# EAGLE design converter (EAGLE 9.4.2)
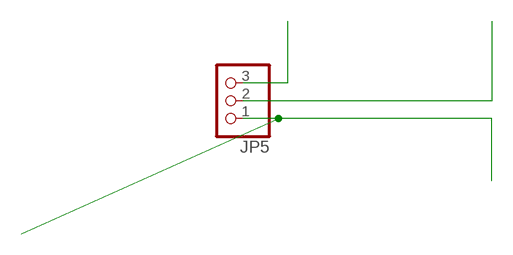
[diagram p0: schematic, sheet 1]

## Parts
JP5  PINHD-1X3  [1X03]

## Nets
N$1: JP5.3
N$2: JP5.2
N$3: JP5.1

## Library data of the parts
JP5 = pinhead:PINHD-1X3: PIN HEADER

## Board
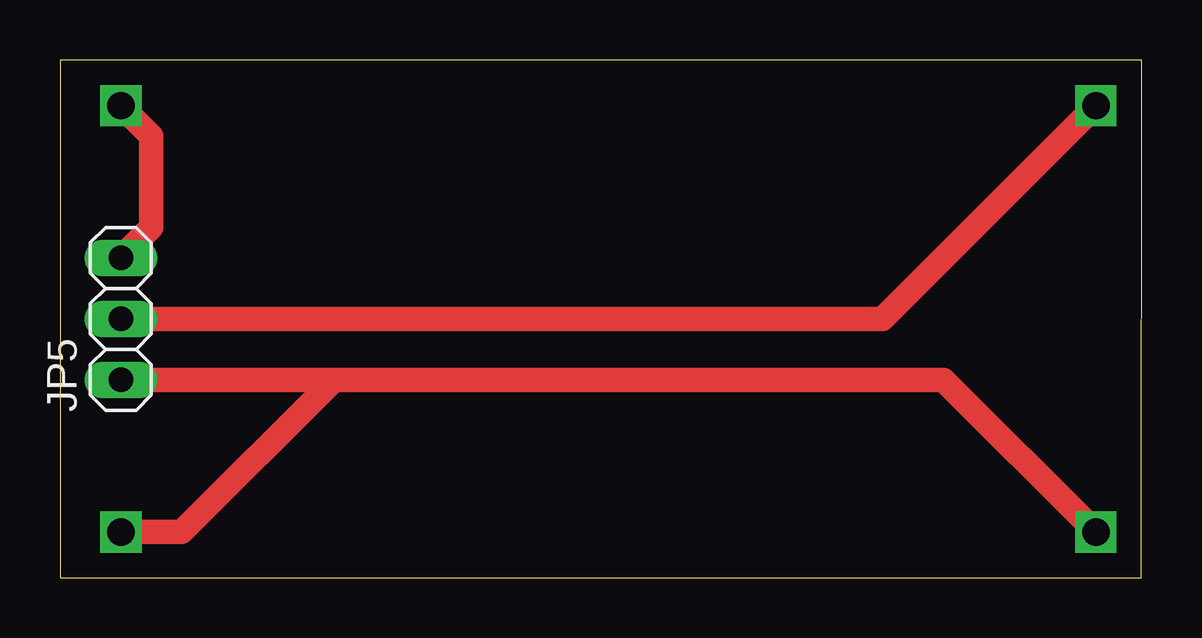
[diagram p1: board, top side]

Size 45.09 x 21.59 mm. Coordinates in mm from the lower left corner, seen from the top.
Outline: 0,0 45.07,0 45.09,21.59 0,21.59 0,0
Copper layers (1*16): Top 0.035mm / dielectric 1.5mm / Bottom 0.035mm
Design rules "default": minimum track width 6mil, minimum drill 0.35mm, track to track 6mil, track to pad 6mil, pad to pad 6mil, via to via 6mil, smd to smd 6mil, copper to edge 40mil, drill to drill 6mil, minimum pad ring 10mil, minimum via ring 8mil, stop-mask expansion 4mil, vias tented up to drill 0mil, thermal gap 10mil

### Footprints (pad centres in the part's own frame; a part is rotated, then mirrored left to right if it is on the bottom)
1X03 = drill 1.016 long: 1 -2.54,0; 2 0,0; 3 2.54,0

### Placement (x,y rotation side)
JP5  2.54,10.8 90 top

### Tracks (layer width: path | path; a pad name or v marks a point on that pad's centre or on a via)
N$1  (via drill 1.14)
  Top 1.016: JP5.3 3.81,14.61 3.81,18.41 v2.54,19.68
N$2  (via drill 1.14)
  Top 1.016: JP5.2 34.29,10.8 v43.18,19.68
N$3  (via drill 1.14)
  Top 1.016: 11.43,8.26 36.83,8.26 v43.18,1.91 | 11.43,8.26 JP5.1 | 11.43,8.26 5.08,1.91 v2.54,1.91